# EAGLE design Node (EAGLE 6.5.0)
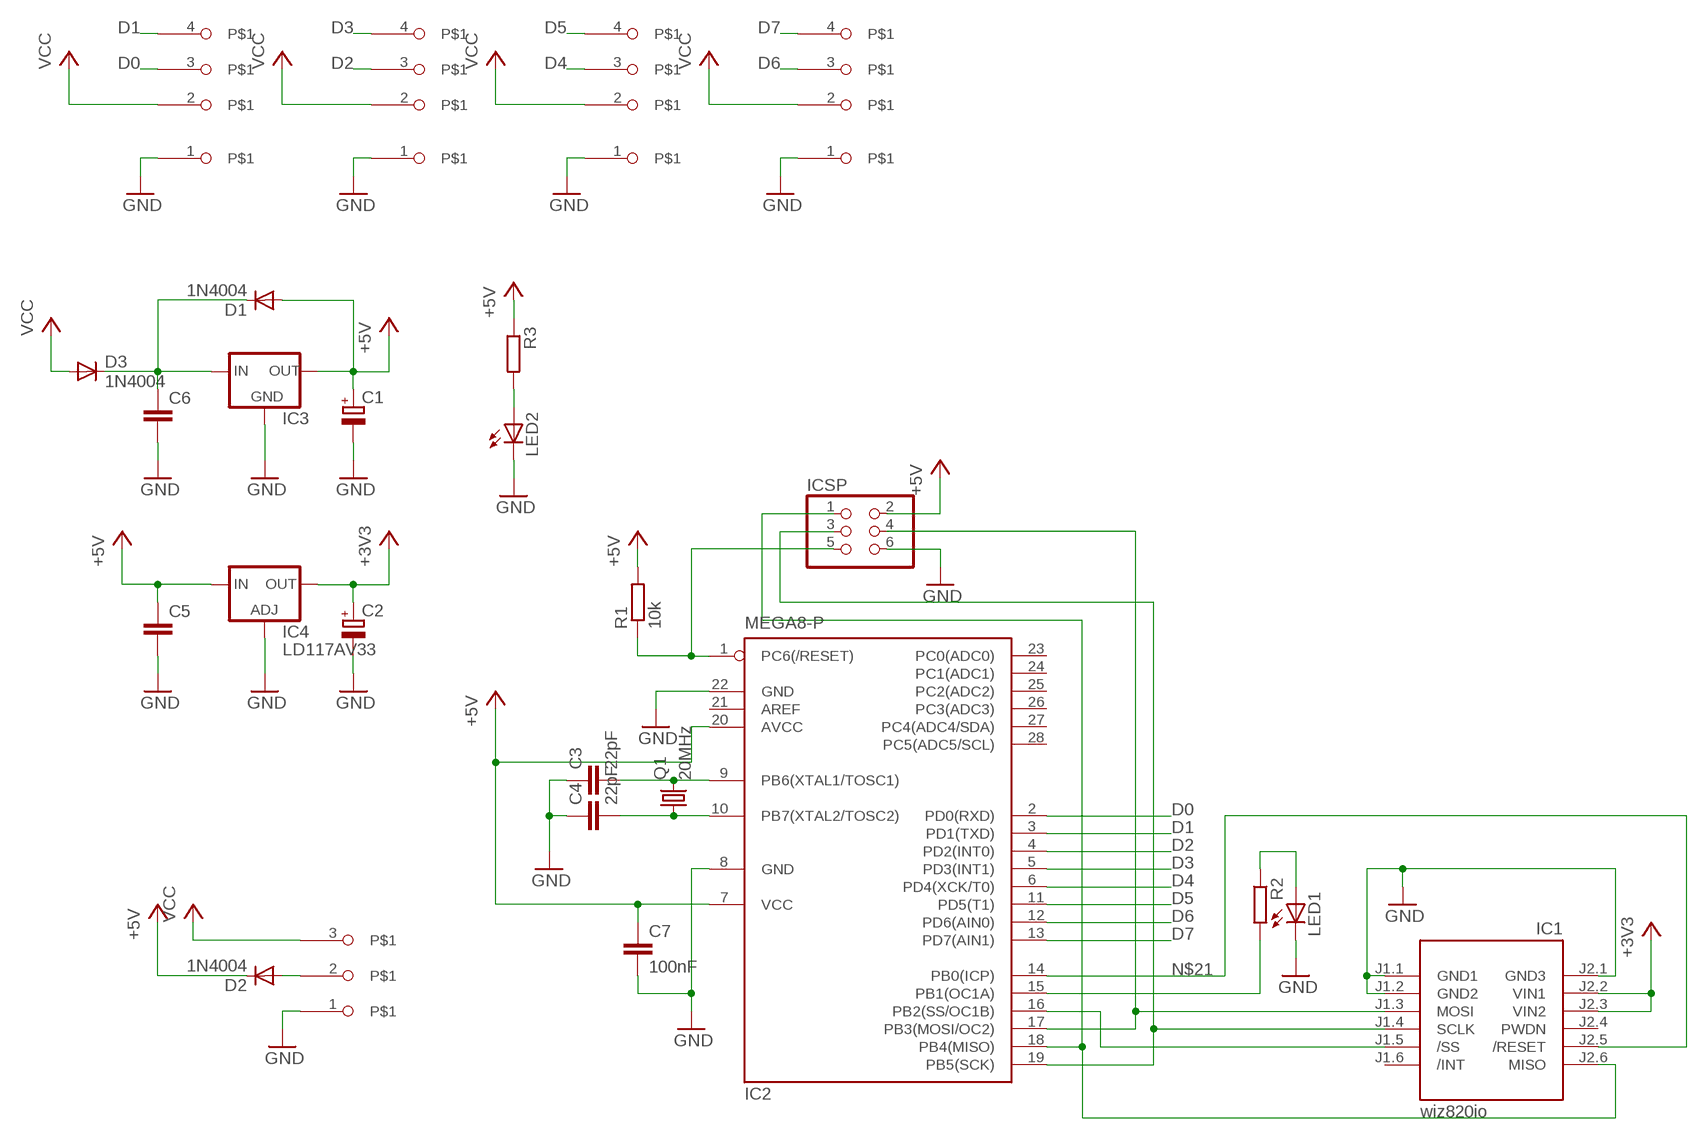
[diagram p0: schematic, sheet 1]

## Parts
C1  CPOL-EUE5-10.5  [E5-10,5]
C2  CPOL-EUE2.5-6  [E2,5-6]
C3  22pF  C-EU025-025X050  [C025-025X050]
C4  22pF  C-EU025-025X050  [C025-025X050]
C5  C-EU025-025X050  [C025-025X050]
C6  C-EU025-025X050  [C025-025X050]
C7  100nF  C-EU025-025X050  [C025-025X050]
D1  1N4004  [DO41-10]
D2  1N4004  [DO41-10]
D3  1N4004  [DO41-10]
IC1  wiz820io  WIZ820IO_DEVICE'DUAL-IN-LINE'  [WIZ820IO]
IC2  MEGA8-P  [DIL28-3]
IC3  78XXL  [78XXL]
IC4  LD117AV33  [TO220L1]
ICSP  PINHD-2X3  [2X03]
LED1  LED3MM  [LED3MM]
LED2  LED3MM  [LED3MM]
Q1  20MHz  CRYSTALHC49S  [HC49/S]
R1  10k  R-EU_0207/10  [0207/10]
R2  R-EU_0207/10  [0207/10]
R3  R-EU_0207/10  [0207/10]
U$1  691322110004  [691322110004]
U$2  691322110004  [691322110004]
U$3  691322110004  [691322110004]
U$4  691322110004  [691322110004]
U$5  CTB9358/3  [CTB9358/3]

## Nets
+3V3: C2.+ IC1.J2.2(VIN1) IC1.J2.3(VIN2) IC4.2(OUT)
+5V: C1.+ C5.1 C7.1 D1.A D2.C IC2.7(VCC) IC2.20(AVCC) IC3.OUT IC4.3(IN) ICSP.2 R1.2 R3.1
D0: IC2.2(PD0(RXD)) U$1.3
D1: IC2.3(PD1(TXD)) U$1.4
D2: IC2.4(PD2(INT0)) U$2.3
D3: IC2.5(PD3(INT1)) U$2.4
D4: IC2.6(PD4(XCK/T0)) U$3.3
D5: IC2.11(PD5(T1)) U$3.4
D6: IC2.12(PD6(AIN0)) U$4.3
D7: IC2.13(PD7(AIN1)) U$4.4
GND: C1.- C2.- C3.1 C4.1 C5.2 C6.2 C7.2 IC1.J1.1(GND1) IC1.J1.2(GND2) IC1.J2.1(GND3) IC2.8(GND) IC2.22(GND) IC3.GND IC4.1(ADJ) ICSP.6 LED1.K(C) LED2.K(C) U$1.1 U$2.1 U$3.1 U$4.1 U$5.1
N$1: LED2.A R3.2
N$2: C3.2 IC2.9(PB6(XTAL1/TOSC1)) Q1.2
N$3: C4.2 IC2.10(PB7(XTAL2/TOSC2)) Q1.1
N$4: IC1.J1.5(/SS) IC2.16(PB2(SS/OC1B))
N$5: IC1.J2.6(MISO) IC2.18(PB4(MISO)) ICSP.1
N$6: D2.A U$5.2
N$7: IC1.J1.3(MOSI) IC2.17(PB3(MOSI/OC2)) ICSP.4
N$8: LED1.A R2.1
N$9: C6.1 D1.C D3.C IC3.IN
N$21: IC1.J2.5(/RESET) IC2.14(PB0(ICP))
N$22: IC2.15(PB1(OC1A)) R2.2
RESET: IC2.1(PC6(/RESET)) ICSP.5 R1.1
SCK: IC1.J1.4(SCLK) IC2.19(PB5(SCK)) ICSP.3
VCC: D3.A U$1.2 U$2.2 U$3.2 U$4.2 U$5.3
Unconnected: IC1.J1.6(/INT) IC1.J2.4(PWDN) IC2.21(AREF) IC2.23(PC0(ADC0)) IC2.24(PC1(ADC1)) IC2.25(PC2(ADC2)) IC2.26(PC3(ADC3)) IC2.27(PC4(ADC4/SDA)) IC2.28(PC5(ADC5/SCL))

## Library data of the parts
C1 C2 = rcl:CPOL-EU: POLARIZED CAPACITOR, European symbol
C3-C7 = rcl:C-EU: CAPACITOR, European symbol
D1-D3 = diode:1N4004: DIODE general purpose rectifier, 1 A
IC1 = Wiz820io:WIZ820IO_DEVICE: WIZnet, WIZ820io plug in module incl. W5200 chip and MagJack
IC2 = atmel:MEGA8-P: MICROCONTROLLER 8 Kbytes FLASH, 1 kbytes SRAM, 512 bytes EEPROM, USART, 4-channel 10 bit ADC, 2-channel 8 bit ADC Pin compatible with Atmega48, ATMega88, ATMega168 Source: avr.lbr; OC_FARNELL: unknown; OC_NEWARK: unknown
IC3 = v-reg:78XXL: VOLTAGE REGULATOR
IC4 = v-reg:LD117A?*: Low drop fixed and adjustable positive voltage regulators 1 A Source: http://www.st.com/stonline/products/literature/ds/7194/ld1117axx.pdf
ICSP = pinhead:PINHD-2X3: PIN HEADER
LED1 LED2 = led:LED: LED OSRAM: - CHIPLED LG R971, LG N971, LY N971, LG Q971, LY Q971, LO R971, LY R971 LH N974, LH R974 LS Q976, LO Q976, LY Q976 LO Q996 - Hyper CHIPLED LW Q18S LB Q993, LB Q99A, LB R99A - SideLED LS A670, LO A670, LY A670, LG A670, LP A670 LB A673, LV A673, LT A673, LW A673 LH A674 LY A675 LS A676, LA A676, LO A676, LY A676, LW A676 LS A679, LY A679, LG A679 - Hyper Micro SIDELED® LS Y876, LA Y876, LO Y876, LY Y876 LT Y87S - SmartLED LW L88C, LW L88S LB L89C, LB L89S, LG L890 LS L89K, LO L89K, LY L89K LS L896, LA L896, LO L896, LY L896 - TOPLED LS T670, LO T670, LY T670, LG T670, LP T670 LSG T670, LSP T670, LSY T670, LOP T670, LYG T670 LG T671, LOG T671, LSG T671 LB T673, LV T673, LT T673, LW T673 LH T674 LS T676, LA T676, LO T676, LY T676, LB T676, LH T676, LSB T676, LW T676 LB T67C, LV T67C, LT T67C, LS T67K, LO T67K, LY T67K, LW E67C LS E67B, LA E67B, LO E67B, LY E67B, LB E67C, LV E67C, LT E67C LW T67C LS T679, LY T679, LG T679 LS T770, LO T770, LY T770, LG T770, LP T770 LB T773, LV T773, LT T773, LW T773 LH T774 LS E675, LA E675, LY E675, LS T675 LS T776, LA T776, LO T776, LY T776, LB T776 LHGB T686 LT T68C, LB T68C - Hyper Mini TOPLED® LB M676 - Mini TOPLED Santana® LG M470 LS M47K, LO M47K, LY M47K Source: http://www.osram.convergy.de LUXEON: - LUMILED® LXK2-PW12-R00, LXK2-PW12-S00, LXK2-PW14-U00, LXK2-PW14-V00 LXK2-PM12-R00, LXK2-PM12-S00, LXK2-PM14-U00 LXK2-PE12-Q00, LXK2-PE12-R00, LXK2-PE12-S00, LXK2-PE14-T00, LXK2-PE14-U00 LXK2-PB12-K00, LXK2-PB12-L00, LXK2-PB12-M00, LXK2-PB14-N00, LXK2-PB14-P00, LXK2-PB14-Q00 LXK2-PR12-L00, LXK2-PR12-M00, LXK2-PR14-Q00, LXK2-PR14-R00 LXK2-PD12-Q00, LXK2-PD12-R00, LXK2-PD12-S00 LXK2-PH12-R00, LXK2-PH12-S00 LXK2-PL12-P00, LXK2-PL12-Q00, LXK2-PL12-R00 Source: www.luxeon.com KINGBRIGHT: KA-3528ASYC Source: www.kingbright.com
Q1 = crystal:CRYSTAL: CRYSTAL; OC_FARNELL: 1667008; OC_NEWARK: unknown
R1-R3 = rcl:R-EU_: RESISTOR, European symbol
U$1-U$4 = con-wurth:691322110004
U$5 = con-wurth:CTB9358/3

## Board
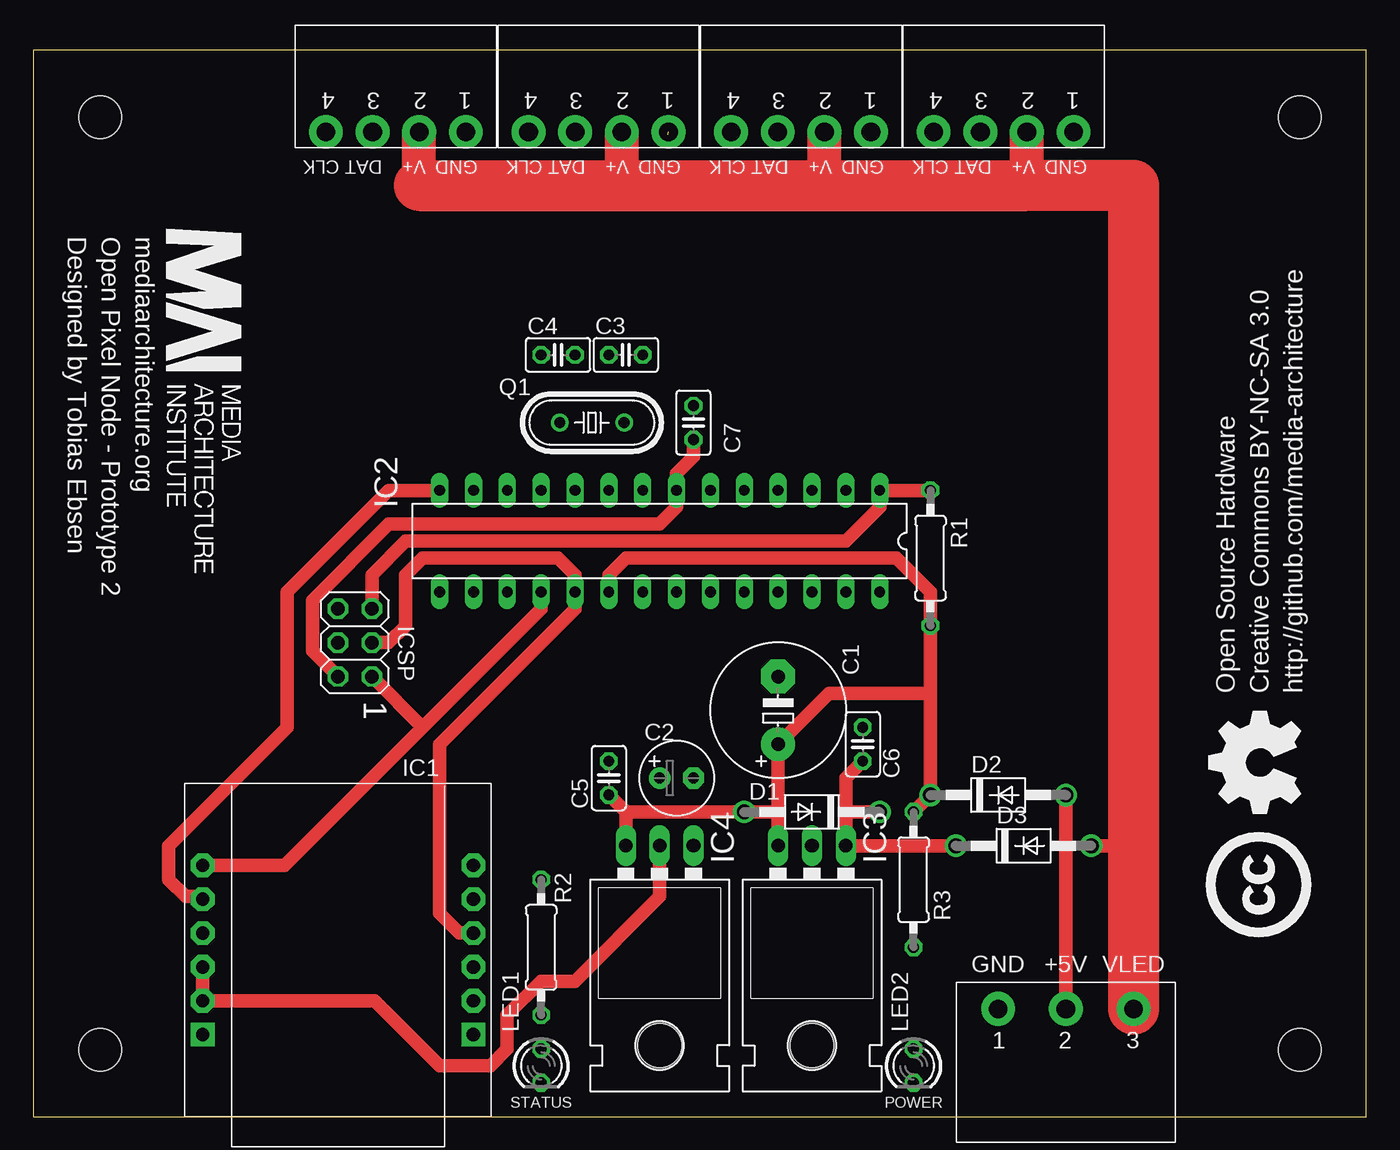
[diagram p1: board, top side]
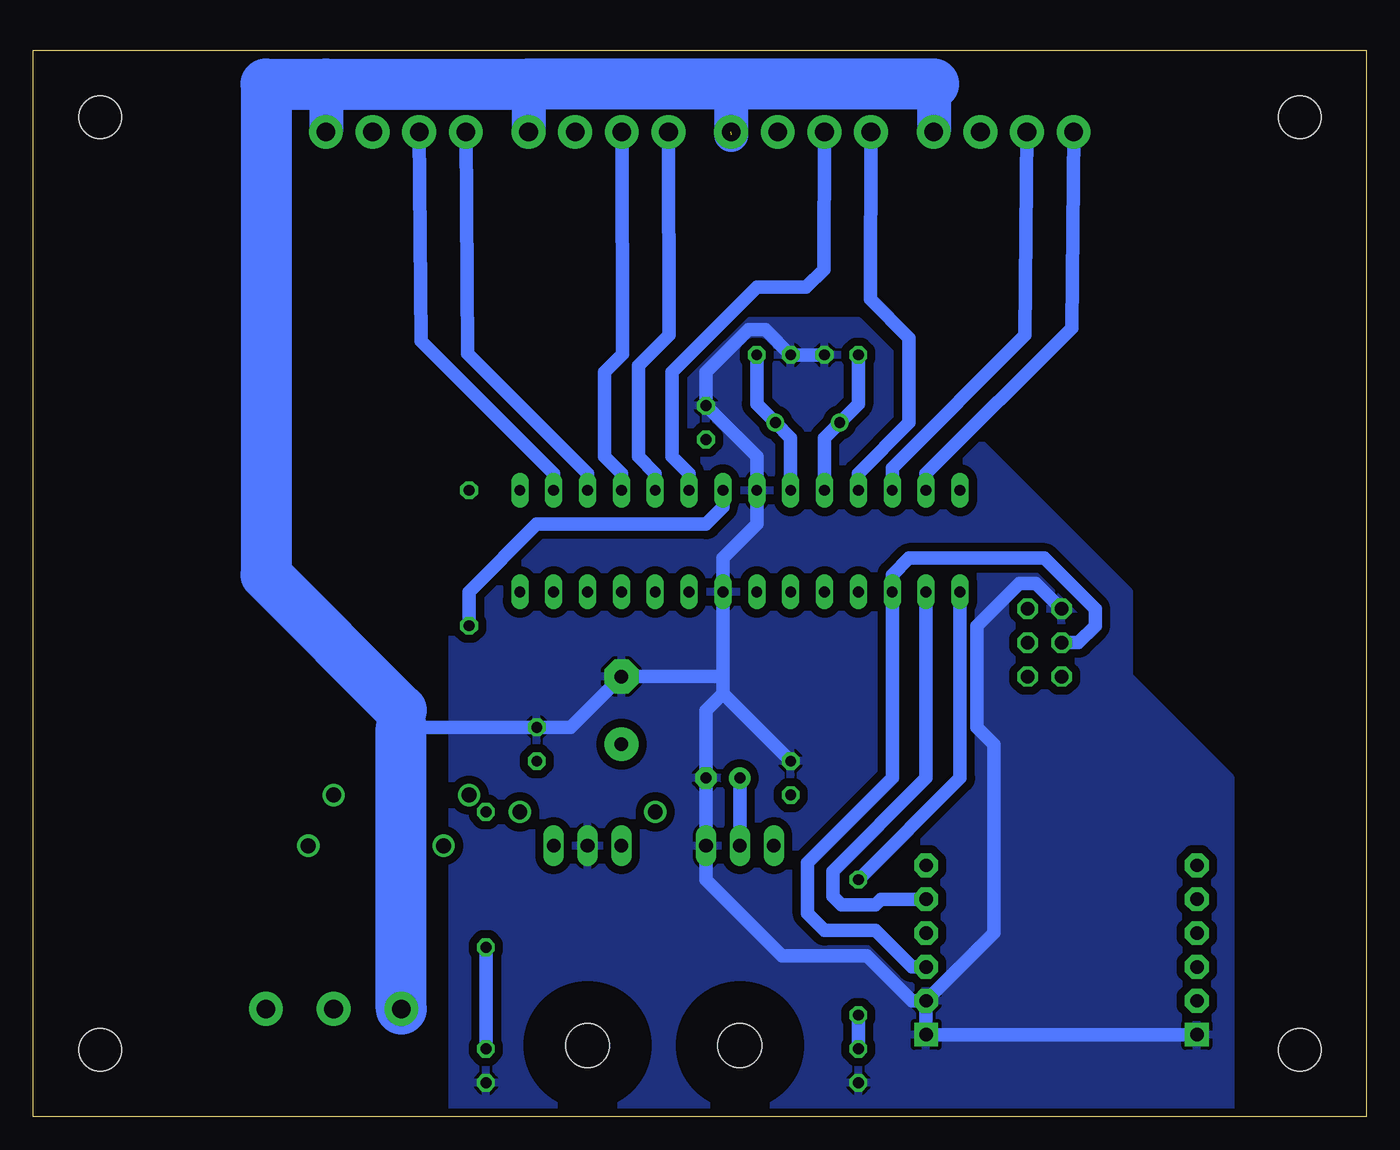
[diagram p2: board, bottom side, seen from below]

Size 100 x 80 mm. Coordinates in mm from the lower left corner, seen from the top.
Outline: 0,0 100,0 100,80 0,80 0,0
Copper layers (1*16): Top 0.035mm / dielectric 1.5mm / Bottom 0.035mm
Design rules "default": minimum track width 6mil, minimum drill 12mil, track to track 6mil, track to pad 6mil, pad to pad 6mil, via to via 6mil, smd to smd 0mil, copper to edge 10mil, drill to drill 10mil, minimum pad ring 10mil, minimum via ring 6mil, stop-mask expansion 2mil, vias tented up to drill 100mil, thermal gap 10mil
Holes 3.2 mm at 5,5 5,75 95,5 95,75

### Footprints (pad centres in the part's own frame; a part is rotated, then mirrored left to right if it is on the bottom)
E5-10,5 = drill 1.016 pad 2.54: + -2.54,0 | drill 1.016 pad 2.54 octagon: - 2.54,0
E2,5-6 = drill 0.813 pad 1.6: + -1.27,0 | drill 0.813 pad 1.6 octagon: - 1.27,0
C025-025X050 = drill 0.813 octagon: 1 -1.27,0; 2 1.27,0
DO41-10 = drill 1.118: A 5.08,0; C -5.08,0
WIZ820IO = drill 1 pad 1.778 square: J1.1 -10.16,6.35; J2.1 10.16,6.35 | drill 1 pad 1.778 octagon: J1.2 -10.16,3.81; J1.3 -10.16,1.27; J1.4 -10.16,-1.27; J1.5 -10.16,-3.81; J1.6 -10.16,-6.35; J2.2 10.16,3.81; J2.3 10.16,1.27; J2.4 10.16,-1.27; J2.5 10.16,-3.81; J2.6 10.16,-6.35
DIL28-3 = drill 0.813 long: 1 -16.51,-3.81; 2 -13.97,-3.81; 3 -11.43,-3.81; 4 -8.89,-3.81; 5 -6.35,-3.81; 6 -3.81,-3.81; 7 -1.27,-3.81; 8 1.27,-3.81; 9 3.81,-3.81; 10 6.35,-3.81; 11 8.89,-3.81; 12 11.43,-3.81; 13 13.97,-3.81; 14 16.51,-3.81; 15 16.51,3.81; 16 13.97,3.81; 17 11.43,3.81; 18 8.89,3.81; 19 6.35,3.81; 20 3.81,3.81; 21 1.27,3.81; 22 -1.27,3.81; 23 -3.81,3.81; 24 -6.35,3.81; 25 -8.89,3.81; 26 -11.43,3.81; 27 -13.97,3.81; 28 -16.51,3.81
78XXL = drill 1.016 long: GND 0,-3.81; IN -2.54,-3.81; OUT 2.54,-3.81 | hole 3.302: 0,11.176
TO220L1 = drill 1.016 long: 1 -2.54,-3.81; 2 0,-3.81; 3 2.54,-3.81 | hole 3.302: 0,11.176
2X03 = drill 1.016 octagon: 1 -2.54,-1.27; 2 -2.54,1.27; 3 0,-1.27; 4 0,1.27; 5 2.54,-1.27; 6 2.54,1.27
LED3MM = drill 0.813 octagon: A -1.27,0; K 1.27,0
HC49/S = drill 0.813: 1 -2.413,0; 2 2.413,0
0207/10 = drill 0.813 octagon: 1 -5.08,0; 2 5.08,0
691322110004 = drill 1.4 pad 2.54: 1 5.25,-4; 2 1.75,-4; 3 -1.75,-4; 4 -5.25,-4
CTB9358/3 = drill 1.4 pad 2.54: 1 5.08,-3.73; 2 0,-3.73; 3 -5.08,-3.73

### Placement (x,y rotation side)
C1  55.88,30.48 90 top
C2  48.26,25.4 0 top
C3  44.45,57.15 0 top
C4  39.37,57.15 180 top
C5  43.18,25.4 90 top
C6  62.23,27.94 90 top
C7  49.53,52.07 90 top
D1  58.42,22.86 180 top
D2  72.39,24.13 0 top
D3  74.3,20.32 0 top
IC1  22.86,12.5 180 top
IC2  46.99,43.18 180 top
IC3  58.42,16.51 180 top
IC4  46.99,16.51 180 top
ICSP  24.13,35.56 90 top
LED1  38.1,3.81 270 top
LED2  66.04,3.81 270 top
Q1  41.91,52.07 0 top
R1  67.31,41.91 270 top
R2  38.1,12.7 90 top
R3  66.04,17.78 270 top
U$1  72.8,77.88 0 top
U$2  57.6,77.88 0 top
U$3  42.4,77.88 0 top
U$4  27.2,77.88 0 top
U$5  77.47,4.35 180 top

### Tracks (layer width: path | path; a pad name or v marks a point on that pad's centre or on a via)
+3V3
  Top 1.016: IC1.J2.3 IC1.J2.2 25.6,8.69 30.48,3.81 34.29,3.81 35.56,5.08 35.56,7.62 38.1,10.16 40.64,10.16 46.99,16.51 IC4.2
  Bottom 1.016: IC4.2 C2.+
+5V
  Top 1.016: 67.31,31.75 D2.C R3.1 | 55.88,22.86 C1.+ 59.69,31.75 67.31,31.75 | IC4.3 44.45,22.86 | 44.45,22.86 D1.A 55.88,22.86 | 44.45,22.86 C5.1 | C7.1 49.53,49.53 48.26,48.26 IC2.7 48.26,45.72 46.99,44.45 26.67,44.45 20.95,38.73 20.95,34.92 ICSP.2 | 67.31,31.75 R1.2 67.31,39.37 64.77,41.91 44.45,41.91 43.18,40.64 IC2.20 | IC3.OUT 55.88,22.86
  Bottom 1.016: IC2.7 48.26,45.72 49.53,44.45 62.23,44.45 67.31,39.37 R1.2
D0
  Bottom 1.016: IC2.2 60.96,48.26 70.9,58.2 U$1.3
D1
  Bottom 1.016: IC2.3 58.42,48.26 67.4,57.24 U$1.4
D2
  Bottom 1.016: IC2.4 55.88,48.26 57.15,49.53 57.15,55.88 55.8,57.23 U$2.3
D3
  Bottom 1.016: IC2.5 53.34,48.26 54.61,49.53 54.61,56.34 52.3,58.65 U$2.4
D4
  Bottom 1.016: IC2.6 50.8,48.26 52.07,49.53 52.07,55.88 45.72,62.23 42.03,62.23 40.7,63.56 U$3.3
D5
  Bottom 1.016: IC2.11 38.1,48.26 34.29,52.07 34.29,58.42 37.2,61.33 U$3.4
D6
  Bottom 1.016: IC2.12 35.56,48.66 25.6,58.62 U$4.3
D7
  Bottom 1.016: IC2.13 33.02,48.26 22.1,59.18 U$4.4
GND  (1 unrouted)
  Bottom 1.016: IC1.J2.1 IC1.J1.1 IC1.J1.2 | C4.1 C3.1 45.09,59.05 46.35,59.05 49.53,55.88 C7.2 45.72,49.53 IC2.8 45.72,44.45 48.26,41.91 IC2.22 48.26,33.02 | ICSP.6 24.77,40.01 26.04,40.01 29.21,36.83 29.21,29.21 27.94,27.94 27.94,13.77 IC1.J1.2 | 72.39,29.21 C6.2 59.69,29.21 C1.- 48.26,33.02 | IC1.J1.2 34.09,8.69 37.47,12.06 43.81,12.06 49.53,17.78 IC4.1 C2.- 49.53,30.48 48.26,31.75 | C5.2 48.26,31.75 | 48.26,31.75 48.26,33.02
  Bottom 2.54: 72.39,29.21 72.39,30.48 | 78.05,77.47 U$1.1 | 32.45,77.47 U$4.1 | U$3.1 47.62,73.88 | 62.85,77.47 U$2.1 | 47.62,73.66 47.62,76.83 46.99,77.47
  Bottom 3.81: 32.45,77.47 46.99,77.47 62.85,77.47 78.05,77.47 82.55,77.47 82.55,40.64 72.39,30.48 | U$5.1 72.39,29.21
  pour Bottom (isolate 0.61): 10.16,0 10.16,25.4 17.78,33.02 17.78,39.37 38.1,59.69 68.58,59.69 68.58,0
N$1
  Bottom 1.016: R3.2 LED2.A
N$2
  Bottom 1.016: IC2.9 43.18,50.93 Q1.2 45.72,53.47 C3.2
N$3
  Bottom 1.016: IC2.10 40.64,50.93 Q1.1 38.1,53.47 C4.2
N$4
  Bottom 1.016: IC1.J1.5 36.4,16.31 36.83,15.88 39.37,15.88 40.01,16.51 40.01,18.41 33.02,25.4 IC2.16
N$5
  Top 1.016: IC1.J2.6 18.85,18.85 29.21,29.21 | IC2.18 38.1,38.1 29.21,29.21 | ICSP.1 29.21,29.21
N$6
  Top 1.016: U$5.2 D2.A
N$7
  Bottom 1.016: IC1.J1.3 34.09,11.23 36.83,13.97 40.64,13.97 41.91,15.24 41.91,19.05 35.56,25.4 IC2.17 35.56,40.64 34.29,41.91 24.13,41.91 20.32,38.1 20.32,36.83 21.59,35.56 ICSP.4
N$8
  Bottom 1.016: LED1.A R2.1
N$9
  Top 1.016: 60.96,22.86 60.96,25.4 C6.1 | D1.C 60.96,22.86 | 60.96,22.86 IC3.IN D3.C
N$21
  Top 1.016: IC2.14 26.67,46.99 19.05,39.37 19.05,29.21 10.16,20.32 10.16,17.78 11.43,16.51 12.5,16.51 IC1.J2.5
N$22
  Bottom 1.016: R2.2 30.48,25.4 IC2.15
RESET
  Top 1.016: R1.1 IC2.1 63.5,45.72 60.96,43.18 27.94,43.18 25.4,40.64 ICSP.5
SCK
  Top 1.016: IC1.J1.4 31.95,13.77 30.48,15.24 30.48,27.94 40.64,38.1 IC2.19 40.64,40.64 39.37,41.91 29.21,41.91 27.94,40.64 27.94,36.83 26.67,35.56 ICSP.3
VCC
  Top 1.016: D3.A 82.55,20.32
  Top 2.54: 28.95,69.85 U$4.2 | 59.35,69.85 U$2.2 | 74.55,69.85 U$1.2 | U$3.2 44.13,73.88 44.13,69.85
  Top 3.81: U$5.3 82.55,20.32 82.55,69.85 74.55,69.85 59.35,69.85 44.13,69.85 28.95,69.85

### Text on the board
tPlace: Open Source Hardware | Creative Commons BY-NC-SA 3.0 | http://github.com/media-architecture
tNames: CLK | DAT | V+ | GND | CLK | DAT | V+ | GND | CLK | DAT | V+ | GND | CLK | DAT | V+ | GND | Designed by Tobias Ebsen | Open Pixel Node - Prototype 2 | mediaarchitecture.org | 1 | GND | +5V | VLED | STATUS | POWER